# Altium schematic sheet Sheet1.SchDoc
size A; SheetNumber: 1; SheetTotal: 1
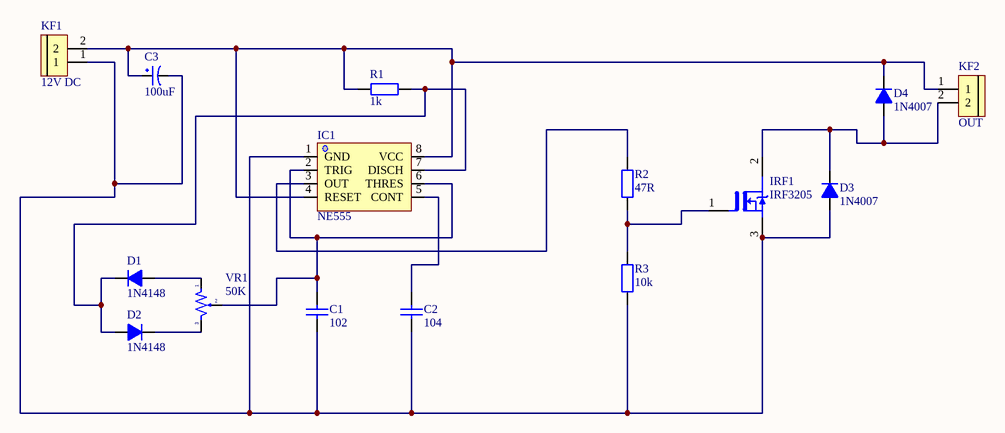
[diagram p0: Sheet1.SchDoc]

## Parts
C1  102  [tu gom]
C2  104  [tu gom]
C3  100uF  [tu hoa 5mm]
D1  1N4148  [DIODE 0.5A]
D2  1N4148  [DIODE 0.5A]
D3  1N4007  [DIODE 1A]
D4  1N4007  [DIODE 1A]
IC1  NE555  [DIP8/W0.3]
IRF1  IRF3205  [QTO-220]
KF1  12V DC  [Con 2 KF301 5.08]
KF2  OUT  [Con 2 KF301 5.08]
R1  1k  [tro vach 1/4w]
R2  47R  [tro vach 1/4w]
R3  10k  [tro vach 1/4w]
VR1  50K  [Bien Tro Volume Don]

## Nets
NetC1_1: C1.1 IC1.2(TRIG) IC1.6(THRES) VR1.2
NetC1_2: C1.2 C2.2 C3.2 D3.1(A) IC1.1(GND) IRF1.3(S) KF1.1 R3.1
NetC2_1: C2.1 IC1.5(CONT)
NetC3_1: C3.1 D4.2(K) IC1.4(RESET) IC1.8(VCC) KF1.2 KF2.1 R1.1
NetD1_1: D1.1(A) VR1.1
NetD1_2: D1.2(K) D2.1(A) IC1.7(DISCH) R1.2
NetD2_2: D2.2(K) VR1.3
NetD3_2: D3.2(K) D4.1(A) IRF1.2(D) KF2.2
NetIC1_3: IC1.3(OUT) R2.1
NetIRF1_1: IRF1.1(G) R2.2 R3.2

## Library data of the parts
C1 = Tu gom 102 50V: Cắm; Don_Vi: Con; So_Chan: 2; Ten_Linh_Kien: Tụ gốm 102 1nF 50V; Ma_Hang: MH004763; Chung_Loai: Cắm; Kieu_Chan: *
C2 = Tu gom 104 50V: Cắm; So_Chan: 2; Ten_Linh_Kien: Tụ gốm 104 100nF 50V; Don_Vi: Con; Ma_Hang: MH004761; Chung_Loai: Cắm; Kieu_Chan: *
C3 = Tu Hoa 100uF 25V 6x11: Cắm; Don_Vi: Con; So_Chan: 2; Ten_Linh_Kien: Tụ Hóa 100uF 25V 6x11MM; Ma_Hang: MH001351; Chung_Loai: Cắm; Kieu_Chan: *
D1 D2 = Diode 1N4148: Cắm; Ten_Linh_Kien: Diode 1N4148 DO35 450mA 100V ( 1N4148 DIP); Don_Vi: Con; Ma_Hang: MH001065; Ghi Chu: *; Kieu_Chan: *; Chung_Loai: Cắm
D3 D4 = Diode 1N4007: Cắm; Ten_Linh_Kien: Diode 1N4007 1A (DIP); Don_Vi: Con; Ma_Hang: MH001063; Ghi Chu: *; Kieu_Chan: *; Chung_Loai: Cắm
KF1 KF2 = CON 2 KF301: Cắm; Ma_Hang: MH000987; Ten_Linh_Kien: CON 2 KF301-2P 5.08MM Xanh Dương; Don_Vi: Con; Chung_Loai: Cắm; Ghi_Chu: *; Kieu_Chan: *
R1 = Tro Vach 1/4W 5% 1k: Cắm; Don_Vi: Con; So_Chan: 2; Ten_Linh_Kien: Trở Vạch 1/4w 5% 1k; Ma_Hang: MH007390; Chung_Loai: Cắm; Kieu_Chan: *
R2 = Tro Vach 1/4W 5% 47R: Cắm; Don_Vi: Con; So_Chan: 2; Ten_Linh_Kien: Trở Vạch 1/4w 5% 47R; Ma_Hang: MH007321; Chung_Loai: Cắm; Kieu_Chan: *
R3 = Tro Vach 1/4W 5% 10k: Căm; Chung_Loai: Cắm; Don_Vi: Con; So_Chan: 2; Ten_Linh_Kien: Trở Vạch 1/4w 5% 10K; Ma_Hang: MH007354; Kieu_Chan: *
VR1 = Triet Ap Don 50k: Cắm; Don_Vi: Con; Ten_Linh_Kien: Triết Áp Đơn B50K; Ma_Hang: MH001419; Kieu_Chan: *; Chung_Loai: Cắm